# Altium project ExtendBoard.PrjPCB
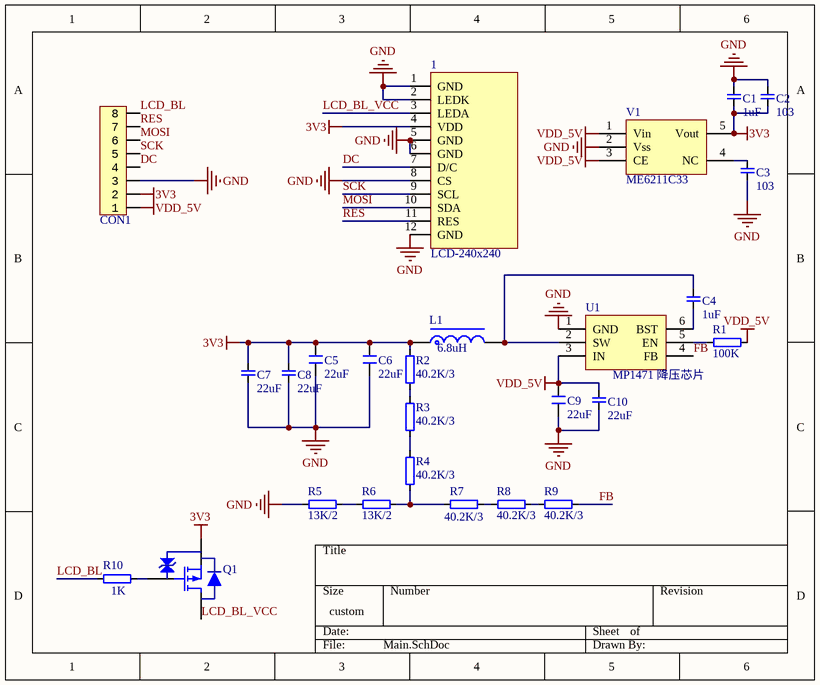
[diagram p0: Main.SchDoc]
1 sheet, 26 parts. Net scope: global (net labels, ports and power ports of the same name join across sheets).
Board file: ExtendBoard.PcbDoc

## Sheet Main.SchDoc
size 152 x 127 mm

### Parts
1  LCD-240x240  [LCD-240x240-NoHole]
C1  1uF  [CAP_0603]
C2  103  [CAP_0603]
C3  103  [CAP_0603]
C4  1uF  [CAP_0603]
C5  22uF  [C 0805_L]
C6  22uF  [C 0805_L]
C7  22uF  [CAP_0603]
C8  22uF  [CAP_0603]
C9  22uF  [C 0805_L]
C10  22uF  [CAP_0603]
CON1  FFC_0.5_8  [FFC_0.5_8]  (value not drawn)
L1  6.8uH  [NR4030]
Q1  AO3415A  [SOT23-3]  (value not drawn)
R1  100K  [RES_0603]
R2  40.2K/3  [RES_0603]
R3  40.2K/3  [RES_0603]
R4  40.2K/3  [RES_0603]
R5  13K/2  [RES_0603]
R6  13K/2  [RES_0603]
R7  40.2K/3  [RES_0603]
R8  40.2K/3  [RES_0603]
R9  40.2K/3  [RES_0603]
R10  1K  [RES_0603]
U1  MP1471 降压芯片  [SOT23-6L]
V1  ME6211C33  [SOT23-5L]

### Nets
3V3: 1.4(VDD) C1.1 C2.1 C5.2 C6.2 C7.2 C8.2 CON1.2 L1.1 Q1.2(S) R2.2 V1.5(Vout)
GND: 1.1(GND) 1.2(LEDK) 1.5(GND) 1.6(GND) 1.8(CS) 1.12(GND) C1.2 C2.2 C3.1 C5.1 C6.1 C7.1 C8.1 C9.1 C10.1 CON1.3 R5.2 U1.1(GND) V1.2(Vss)
VDD_5V: C9.2 C10.2 CON1.1 R1.1 U1.3(IN) V1.1(Vin) V1.3(CE)
DC: 1.7(D/C) CON1.4
FB: R9.1 U1.4(FB)
LCD_BL: CON1.8 R10.2
LCD_BL_VCC: 1.3(LEDA) Q1.3(D)
MOSI: 1.10(SDA) CON1.6
RES: 1.11(RES) CON1.7
SCK: 1.9(SCL) CON1.5
NetC3_2: C3.2 V1.4(NC)
NetC4_1: C4.1 U1.6(BST)
NetC4_2: C4.2 L1.2 U1.2(SW)
NetQ1_1: Q1.1(G) R10.1
NetR1_2: R1.2 U1.5(EN)
NetR2_1: R2.1 R3.2
NetR3_1: R3.1 R4.2
NetR4_1: R4.1 R6.1 R7.2
NetR5_1: R5.1 R6.2
NetR7_1: R7.1 R8.2
NetR8_1: R8.1 R9.2

### Library data of the parts
1 = LCD-240x240: 显示屏
C1-C4 C7 C8 C10 = cap
C5 C6 C9 = C: 无极性贴片电容; 材质: X7R; BOM名称: 无极性贴片电容
CON1 = FFC_0.5_8: FFC; System: Connector
L1 = L-NR: NR磁胶电感; BOM名称: NR磁胶电感
Q1 = AO3415A: MOSFET; Published: 8-Jun-2000; LatestRevisionDate: 17-Jul-2002; LatestRevisionNote: Re-released for DXP Platform.; PackageVersion: 1995/1996; PackageReference: E3; Publisher: Altium Limited; PackageDescription: TO, Flat Index; 3 In-Line, Axial Leads; Body Dia. 4.6mm; Lead Dia. 0.5 mm (max)
R1-R10 = Res
U1 = MP1471: DC降压芯片; BOM名称: DC降压芯片
V1 = ME6211: 低功耗LDO; BOM名称: 低功耗LDO